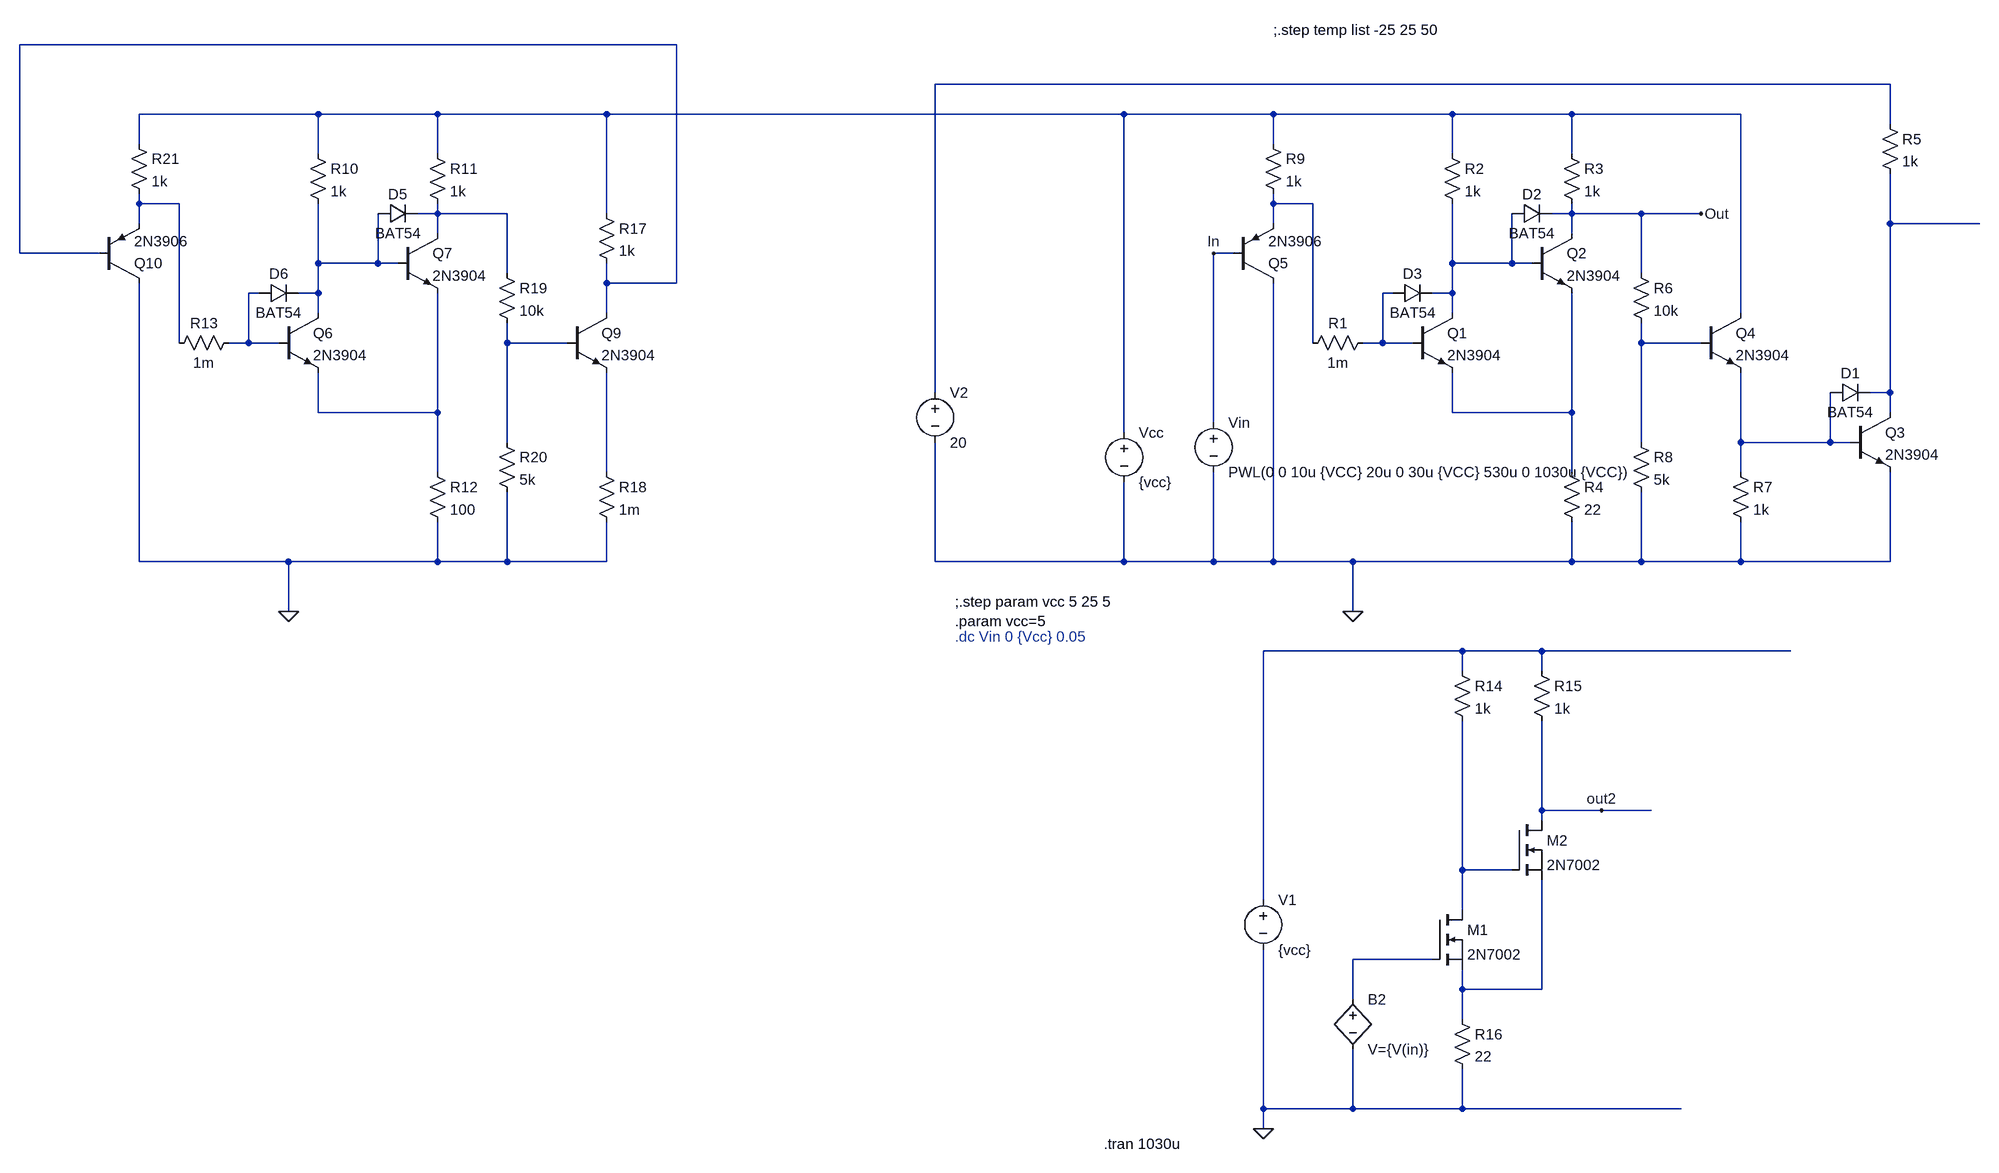
[diagram p0: schematic current_regulator1.asc]
current_regulator1.asc, the LTspice schematic file:
Version 4.1
SHEET 1 3940 3804
WIRE -1040 -352 -2096 -352
WIRE 912 -288 -624 -288
WIRE -1616 -240 -1904 -240
WIRE -1424 -240 -1616 -240
WIRE -1152 -240 -1424 -240
WIRE -320 -240 -1152 -240
WIRE -80 -240 -320 -240
WIRE 208 -240 -80 -240
WIRE 400 -240 208 -240
WIRE 672 -240 400 -240
WIRE 912 -224 912 -288
WIRE -1904 -192 -1904 -240
WIRE -80 -192 -80 -240
WIRE -1616 -176 -1616 -240
WIRE -1424 -176 -1424 -240
WIRE 208 -176 208 -240
WIRE 400 -176 400 -240
WIRE -1904 -96 -1904 -112
WIRE -1840 -96 -1904 -96
WIRE -80 -96 -80 -112
WIRE -16 -96 -80 -96
WIRE -1424 -80 -1424 -96
WIRE -1424 -80 -1456 -80
WIRE -1312 -80 -1424 -80
WIRE -1152 -80 -1152 -240
WIRE 400 -80 400 -96
WIRE 400 -80 368 -80
WIRE 512 -80 400 -80
WIRE 608 -80 512 -80
WIRE -1904 -64 -1904 -96
WIRE -80 -64 -80 -96
WIRE 912 -64 912 -144
WIRE 1056 -64 912 -64
WIRE -1424 -48 -1424 -80
WIRE 400 -48 400 -80
WIRE -2096 -16 -2096 -352
WIRE -1968 -16 -2096 -16
WIRE -144 -16 -176 -16
WIRE -1616 0 -1616 -96
WIRE -1520 0 -1520 -80
WIRE -1520 0 -1616 0
WIRE -1488 0 -1520 0
WIRE 208 0 208 -96
WIRE 304 0 304 -80
WIRE 304 0 208 0
WIRE 336 0 304 0
WIRE -1312 16 -1312 -80
WIRE 512 16 512 -80
WIRE -1152 32 -1152 0
WIRE -1040 32 -1040 -352
WIRE -1040 32 -1152 32
WIRE -1712 48 -1728 48
WIRE -1616 48 -1616 0
WIRE -1616 48 -1648 48
WIRE 112 48 96 48
WIRE 208 48 208 0
WIRE 208 48 176 48
WIRE -1616 80 -1616 48
WIRE -1152 80 -1152 32
WIRE 208 80 208 48
WIRE 672 80 672 -240
WIRE -1840 128 -1840 -96
WIRE -1728 128 -1728 48
WIRE -1728 128 -1760 128
WIRE -1680 128 -1728 128
WIRE -1312 128 -1312 96
WIRE -1216 128 -1312 128
WIRE -16 128 -16 -96
WIRE 96 128 96 48
WIRE 96 128 64 128
WIRE 144 128 96 128
WIRE 512 128 512 96
WIRE 608 128 512 128
WIRE -624 208 -624 -288
WIRE 912 208 912 -64
WIRE 912 208 880 208
WIRE -1616 240 -1616 176
WIRE -1424 240 -1424 48
WIRE -1424 240 -1616 240
WIRE 208 240 208 176
WIRE 400 240 400 48
WIRE 400 240 208 240
WIRE 912 240 912 208
WIRE -176 256 -176 -16
WIRE -320 272 -320 -240
WIRE -1312 288 -1312 128
WIRE 512 288 512 128
WIRE 672 288 672 176
WIRE 816 288 816 208
WIRE 816 288 672 288
WIRE 848 288 816 288
WIRE -1424 336 -1424 240
WIRE -1152 336 -1152 176
WIRE 400 336 400 240
WIRE 672 336 672 288
WIRE -1904 480 -1904 32
WIRE -1664 480 -1904 480
WIRE -1424 480 -1424 416
WIRE -1424 480 -1664 480
WIRE -1312 480 -1312 368
WIRE -1312 480 -1424 480
WIRE -1152 480 -1152 416
WIRE -1152 480 -1312 480
WIRE -624 480 -624 288
WIRE -320 480 -320 352
WIRE -320 480 -624 480
WIRE -176 480 -176 336
WIRE -176 480 -320 480
WIRE -80 480 -80 32
WIRE -80 480 -176 480
WIRE 48 480 -80 480
WIRE 400 480 400 416
WIRE 400 480 48 480
WIRE 512 480 512 368
WIRE 512 480 400 480
WIRE 672 480 672 416
WIRE 672 480 512 480
WIRE 912 480 912 336
WIRE 912 480 672 480
WIRE -1664 560 -1664 480
WIRE 48 560 48 480
WIRE 224 624 -96 624
WIRE 352 624 224 624
WIRE 752 624 352 624
WIRE 224 656 224 624
WIRE 352 656 352 624
WIRE 352 880 352 736
WIRE 448 880 352 880
WIRE 528 880 448 880
WIRE 352 896 352 880
WIRE 224 976 224 736
WIRE 304 976 224 976
WIRE -96 1024 -96 624
WIRE 224 1040 224 976
WIRE 176 1120 48 1120
WIRE 224 1168 224 1136
WIRE 352 1168 352 992
WIRE 352 1168 224 1168
WIRE 48 1184 48 1120
WIRE 224 1216 224 1168
WIRE -96 1360 -96 1104
WIRE 48 1360 48 1264
WIRE 48 1360 -96 1360
WIRE 224 1360 224 1296
WIRE 224 1360 48 1360
WIRE 576 1360 224 1360
WIRE -96 1392 -96 1360
FLAG 48 560 0
FLAG 608 -80 Out
FLAG -176 -16 In
FLAG -96 1392 0
FLAG 448 880 out2
FLAG -1664 560 0
SYMBOL npn 144 80 R0
SYMATTR InstName Q1
SYMATTR Value 2N3904
SYMBOL npn 336 -48 R0
SYMATTR InstName Q2
SYMATTR Value 2N3904
SYMBOL voltage -176 240 R0
WINDOW 123 0 0 Left 0
WINDOW 39 0 0 Left 0
SYMATTR InstName Vin
SYMATTR Value PWL(0 0 10u {VCC} 20u 0 30u {VCC} 530u 0 1030u {VCC})
SYMBOL voltage -320 256 R0
SYMATTR InstName Vcc
SYMATTR Value {vcc}
SYMBOL res 192 -192 R0
SYMATTR InstName R2
SYMATTR Value 1k
SYMBOL res 384 -192 R0
SYMATTR InstName R3
SYMATTR Value 1k
SYMBOL res 384 320 R0
SYMATTR InstName R4
SYMATTR Value 22
SYMBOL res 80 112 R90
WINDOW 0 0 56 VBottom 2
WINDOW 3 32 56 VTop 2
SYMATTR InstName R1
SYMATTR Value 1m
SYMBOL nmos 176 1040 R0
SYMATTR InstName M1
SYMATTR Value 2N7002
SYMBOL nmos 304 896 R0
SYMATTR InstName M2
SYMATTR Value 2N7002
SYMBOL res 208 640 R0
SYMATTR InstName R14
SYMATTR Value 1k
SYMBOL res 336 640 R0
SYMATTR InstName R15
SYMATTR Value 1k
SYMBOL res 208 1200 R0
SYMATTR InstName R16
SYMATTR Value 22
SYMBOL voltage -96 1008 R0
SYMATTR InstName V1
SYMATTR Value {vcc}
SYMBOL bv 48 1168 R0
SYMATTR InstName B2
SYMATTR Value V={V(in)}
SYMBOL voltage -624 192 R0
SYMATTR InstName V2
SYMATTR Value 20
SYMBOL npn 848 240 R0
SYMATTR InstName Q3
SYMATTR Value 2N3904
SYMBOL res 896 -240 R0
SYMATTR InstName R5
SYMATTR Value 1k
SYMBOL res 656 320 R0
SYMATTR InstName R7
SYMATTR Value 1k
SYMBOL diode 816 224 R270
WINDOW 0 32 32 VTop 2
WINDOW 3 0 32 VBottom 2
SYMATTR InstName D1
SYMATTR Value BAT54
SYMBOL npn 608 80 R0
SYMATTR InstName Q4
SYMATTR Value 2N3904
SYMBOL res 496 0 R0
SYMATTR InstName R6
SYMATTR Value 10k
SYMBOL res 496 272 R0
SYMATTR InstName R8
SYMATTR Value 5k
SYMBOL diode 304 -64 R270
WINDOW 0 32 32 VTop 2
WINDOW 3 0 32 VBottom 2
SYMATTR InstName D2
SYMATTR Value BAT54
SYMBOL diode 112 64 R270
WINDOW 0 32 32 VTop 2
WINDOW 3 0 32 VBottom 2
SYMATTR InstName D3
SYMATTR Value BAT54
SYMBOL res -96 -208 R0
SYMATTR InstName R9
SYMATTR Value 1k
SYMBOL pnp -144 32 M180
SYMATTR InstName Q5
SYMATTR Value 2N3906
SYMBOL npn -1680 80 R0
SYMATTR InstName Q6
SYMATTR Value 2N3904
SYMBOL npn -1488 -48 R0
SYMATTR InstName Q7
SYMATTR Value 2N3904
SYMBOL res -1632 -192 R0
SYMATTR InstName R10
SYMATTR Value 1k
SYMBOL res -1440 -192 R0
SYMATTR InstName R11
SYMATTR Value 1k
SYMBOL res -1440 320 R0
SYMATTR InstName R12
SYMATTR Value 100
SYMBOL res -1744 112 R90
WINDOW 0 0 56 VBottom 2
WINDOW 3 32 56 VTop 2
SYMATTR InstName R13
SYMATTR Value 1m
SYMBOL res -1168 320 R0
SYMATTR InstName R18
SYMATTR Value 1m
SYMBOL npn -1216 80 R0
SYMATTR InstName Q9
SYMATTR Value 2N3904
SYMBOL res -1328 0 R0
SYMATTR InstName R19
SYMATTR Value 10k
SYMBOL res -1328 272 R0
SYMATTR InstName R20
SYMATTR Value 5k
SYMBOL diode -1520 -64 R270
WINDOW 0 32 32 VTop 2
WINDOW 3 0 32 VBottom 2
SYMATTR InstName D5
SYMATTR Value BAT54
SYMBOL diode -1712 64 R270
WINDOW 0 32 32 VTop 2
WINDOW 3 0 32 VBottom 2
SYMATTR InstName D6
SYMATTR Value BAT54
SYMBOL res -1920 -208 R0
SYMATTR InstName R21
SYMATTR Value 1k
SYMBOL pnp -1968 32 M180
SYMATTR InstName Q10
SYMATTR Value 2N3906
SYMBOL res -1168 -96 R0
SYMATTR InstName R17
SYMATTR Value 1k
TEXT -592 600 Left 2 ;.dc Vin 0 {Vcc} 0.05
TEXT -592 544 Left 2 !;.step param vcc 5 25 5\n.param vcc=5
TEXT -80 -376 Left 2 !;.step temp list -25 25 50
TEXT -352 1416 Left 2 !.tran 1030u

The netlist it stands for:
* current_regulator1.asc
Q1 N009 N011 N015 0 2N3904
Q2 Out N009 N015 0 2N3904
Vin In 0 PWL(0 0 10u {VCC} 20u 0 30u {VCC} 530u 0 1030u {VCC})
Vcc N003 0 {vcc}
R2 N003 N009 1k
R3 N003 Out 1k
R4 N015 0 22
R1 N011 N005 1m
M1 N019 N020 N021 N021 2N7002
M2 out2 N019 N021 N021 2N7002
R14 N018 N019 1k
R15 N018 out2 1k
R16 N021 0 22
V1 N018 0 {vcc}
B2 N020 0 V={V(in)}
V2 N002 0 20
Q3 N007 N016 0 0 2N3904
R5 N002 N007 1k
R7 N016 0 1k
D1 N016 N007 BAT54
Q4 N003 N013 N016 0 2N3904
R6 Out N013 10k
R8 N013 0 5k
D2 N009 Out BAT54
D3 N011 N009 BAT54
R9 N003 N005 1k
Q5 0 In N005 0 2N3906
Q6 N008 N010 N014 0 2N3904
Q7 N006 N008 N014 0 2N3904
R10 N003 N008 1k
R11 N003 N006 1k
R12 N014 0 100
R13 N010 N004 1m
R18 N017 0 1m
Q9 N001 N012 N017 0 2N3904
R19 N006 N012 10k
R20 N012 0 5k
D5 N008 N006 BAT54
D6 N010 N008 BAT54
R21 N003 N004 1k
Q10 0 N001 N004 0 2N3906
R17 N003 N001 1k
.model D D
.lib standard.dio
.model NPN NPN
.model PNP PNP
.lib standard.bjt
.model NMOS NMOS
.model PMOS PMOS
.lib standard.mos
* .dc Vin 0 {Vcc} 0.05
;.step param vcc 5 25 5
.param vcc=5
;.step temp list -25 25 50
.tran 1030u
.backanno
.end